# Altium schematic sheet Sheet2.SchDoc
size A4
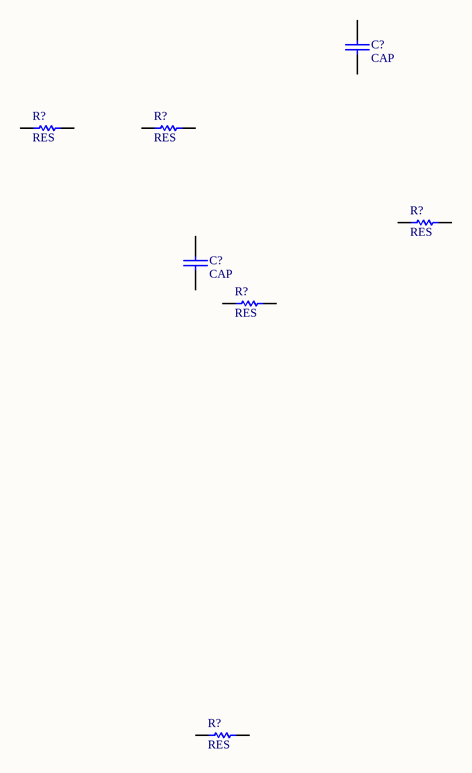
[diagram p0: Sheet2.SchDoc]

## Parts
(Parts that share a designator on the sheet are numbered #1, #2 ... from top to bottom, then left to right.)
C?#1  CAP  [CAP200]
C?#2  CAP  [CAP200]
R?#1  RES  [RES400]
R?#2  RES  [RES400]
R?#3  RES  [RES400]
R?#4  RES  [RES400]
R?#5  RES  [RES400]

## Nets

Not connected (* = marked no-connect by the designer): C?#1 1 2; C?#2 1 2; R?#1 1 2; R?#2 1 2; R?#3 1 2; R?#4 1 2; R?#5 1 2